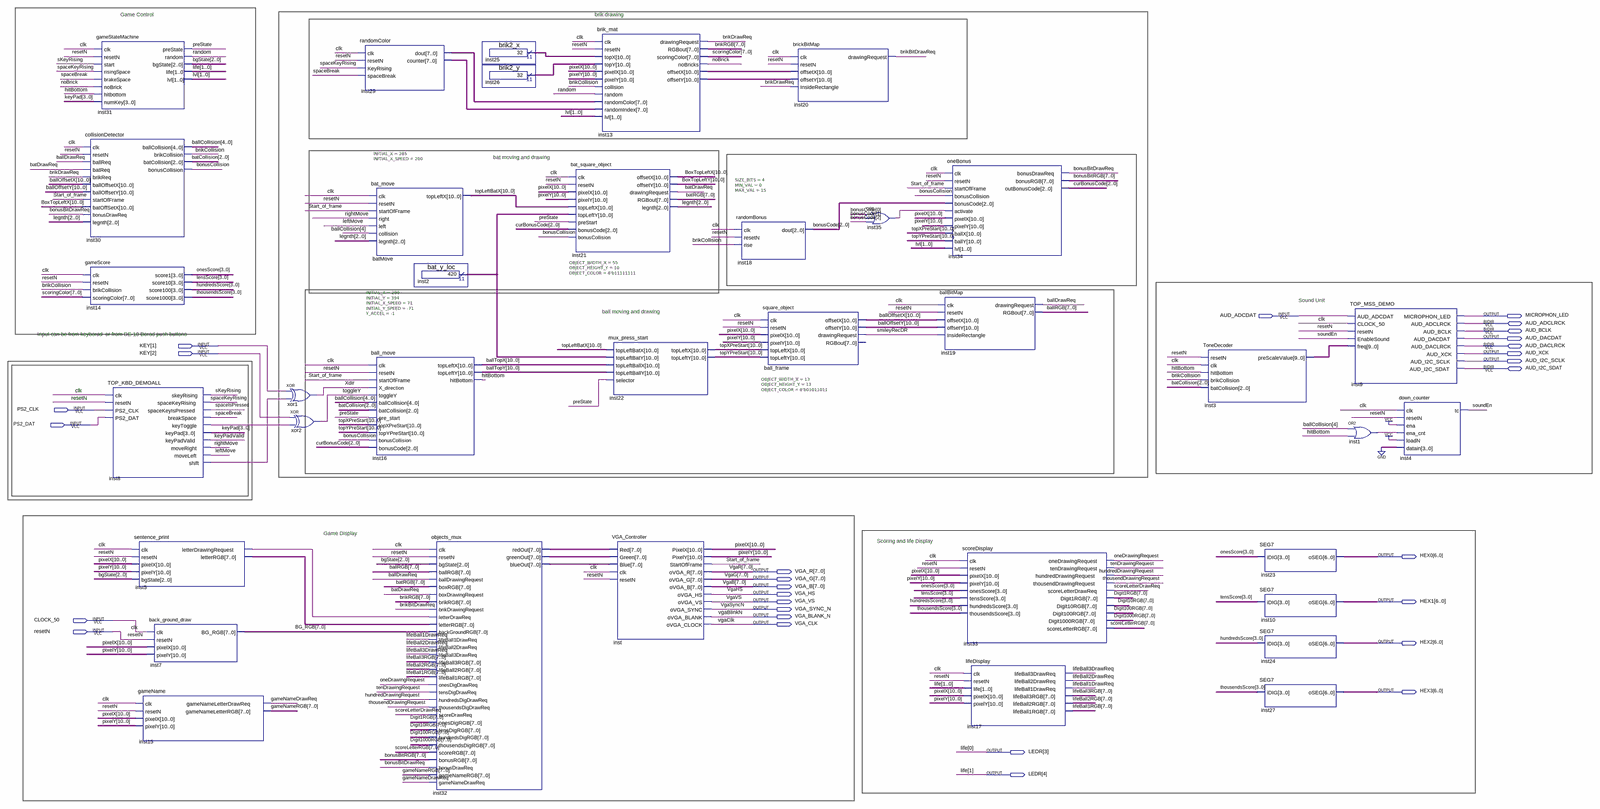
[diagram p0: schematic sheet, whole]
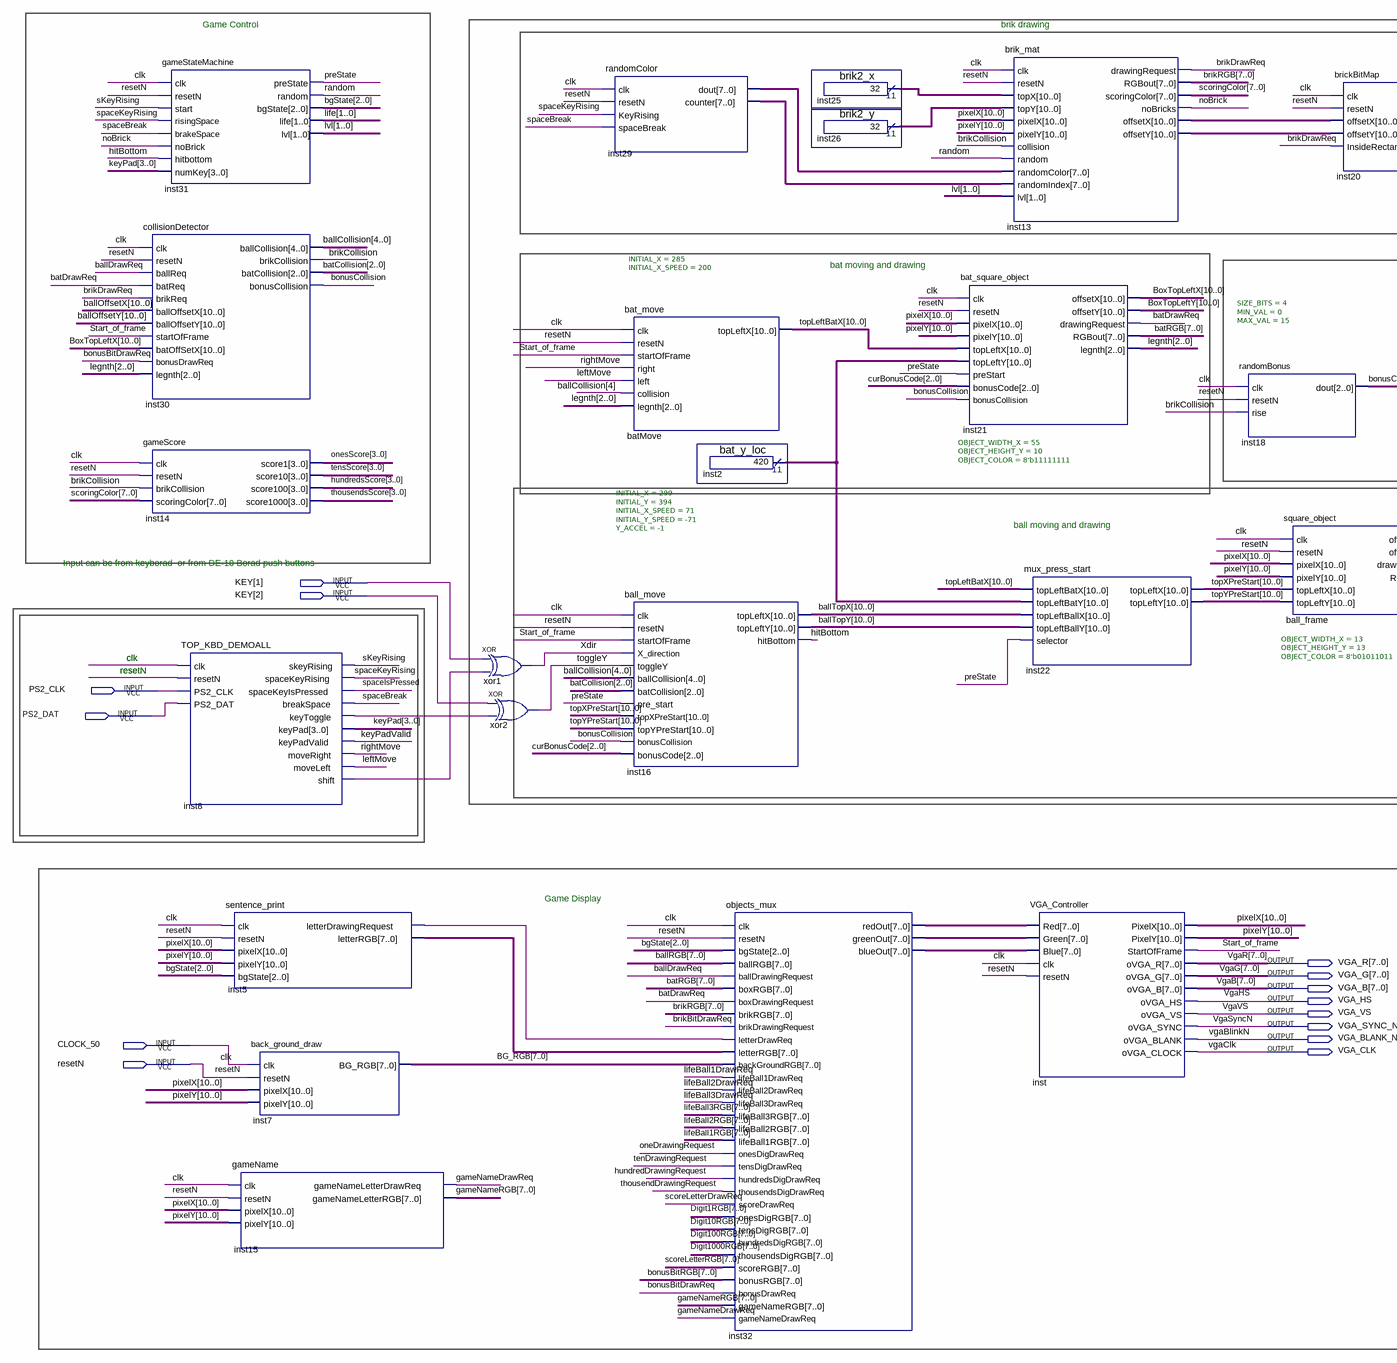
[diagram p1: schematic sheet, left part]
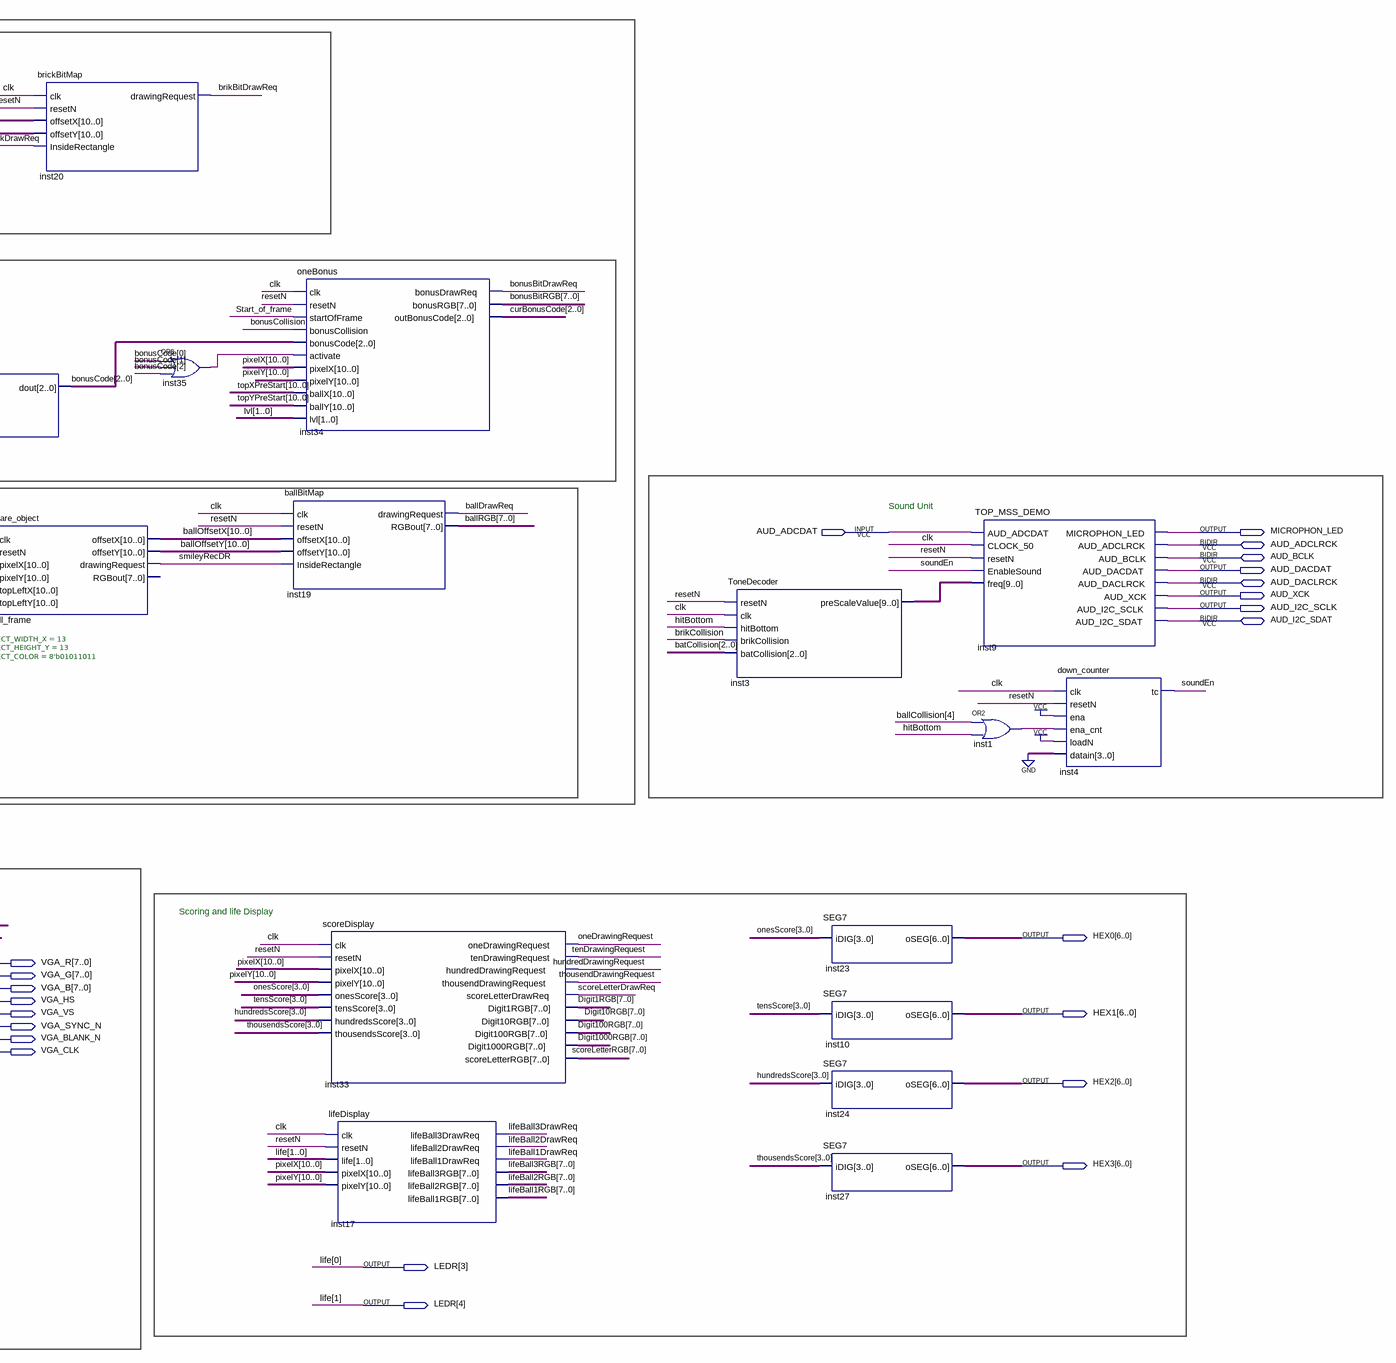
[diagram p2: schematic sheet, right part]
// Quartus schematic TOP_VGA_WITH_MSS_ALL.bdf as structural Verilog: 36 symbols, 29 pins
module TOP_VGA_WITH_MSS_ALL (
  input  AUD_ADCDAT,
  input  [2:1] KEY,
  input  PS2_CLK,
  input  PS2_DAT,
  input  CLOCK_50,
  input  resetN,
  inout  AUD_ADCLRCK,
  inout  AUD_BCLK,
  inout  AUD_DACLRCK,
  inout  AUD_I2C_SDAT,
  output MICROPHON_LED,
  output AUD_DACDAT,
  output AUD_XCK,
  output AUD_I2C_SCLK,
  output [6:0] HEX0,
  output [7:0] VGA_R,
  output [7:0] VGA_G,
  output [7:0] VGA_B,
  output VGA_HS,
  output VGA_VS,
  output [6:0] HEX1,
  output VGA_SYNC_N,
  output VGA_BLANK_N,
  output VGA_CLK,
  output [6:0] HEX2,
  output [6:0] HEX3,
  output [4:3] LEDR
);

  wire ballDrawReq, batDrawReq, bonusBitDrawReq, bonusCollision, brikBitDrawReq, brikCollision, brikDrawReq,
       gameNameDrawReq, hitBottom, hundredDrawingRequest, inst1_out, inst5_letterdrawingrequest,
       inst8_keytoggle, inst8_shift, inst35_out, keyPadValid, leftMove, lifeBall1DrawReq, lifeBall2DrawReq,
       lifeBall3DrawReq, noBrick, oneDrawingRequest, preState, random, rightMove, scoreLetterDrawReq,
       sKeyRising, smileyRecDR, soundEn, spaceBreak, spaceIsPressed, spaceKeyRising, Start_of_frame,
       tenDrawingRequest, thousendDrawingRequest, toggleY, Xdir;
  wire [1:0] lvl;
  wire [2:0] batCollision, bgState, bonusCode, curBonusCode, legnth;
  wire [3:0] hundredsScore, keyPad, onesScore, tensScore, thousendsScore;
  wire [4:0] ballCollision;
  wire [7:0] ballRGB, batRGB, BG_RGB, bonusBitRGB, brikRGB, Digit1RGB, Digit10RGB, Digit100RGB, Digit1000RGB,
       gameNameRGB, inst5_letterrgb, inst29_counter, inst29_dout, inst32_blueout, inst32_greenout,
       inst32_redout, lifeBall1RGB, lifeBall2RGB, lifeBall3RGB, scoreLetterRGB, scoringColor;
  wire [9:0] inst3_prescalevalue;
  wire [10:0] ballOffsetX, ballOffsetY, ballTopX, ballTopY, BoxTopLeftX, BoxTopLeftY, inst2_result,
       inst13_offsetx, inst13_offsety, inst25_result, inst26_result, pixelX, pixelY, topLeftBatX,
       topXPreStart, topYPreStart;

  gameStateMachine inst31 (
    .clk(CLOCK_50), .resetN(resetN), .start(sKeyRising), .risingSpace(spaceKeyRising),
    .brakeSpace(spaceBreak), .noBrick(noBrick), .hitbottom(hitBottom), .numKey(keyPad), .preState(preState),
    .random(random), .bgState(bgState), .life(LEDR), .lvl(lvl));
  collisionDetector inst30 (
    .clk(CLOCK_50), .resetN(resetN), .ballReq(ballDrawReq), .batReq(batDrawReq), .brikReq(brikDrawReq),
    .ballOffsetX(ballOffsetX), .ballOffsetY(ballOffsetY), .startOfFrame(Start_of_frame),
    .batOffSetX(BoxTopLeftX), .bonusDrawReq(bonusBitDrawReq), .legnth(legnth), .ballCollision(ballCollision),
    .brikCollision(brikCollision), .batCollision(batCollision), .bonusCollision(bonusCollision));
  gameScore inst14 (
    .clk(CLOCK_50), .resetN(resetN), .brikCollision(brikCollision), .scoringColor(scoringColor),
    .score1(onesScore), .score10(tensScore), .score100(hundredsScore), .score1000(thousendsScore));
  TOP_KBD_DEMOALL inst8 (
    .clk(CLOCK_50), .resetN(resetN), .PS2_CLK(PS2_CLK), .PS2_DAT(PS2_DAT), .skeyRising(sKeyRising),
    .spaceKeyRising(spaceKeyRising), .spaceKeyIsPressed(spaceIsPressed), .breakSpace(spaceBreak),
    .keyToggle(inst8_keytoggle), .keyPad(keyPad), .keyPadValid(keyPadValid), .moveRight(rightMove),
    .moveLeft(leftMove), .shift(inst8_shift));
  sentence_print inst5 (
    .clk(CLOCK_50), .resetN(resetN), .pixelX(pixelX), .pixelY(pixelY), .bgState(bgState),
    .letterDrawingRequest(inst5_letterdrawingrequest), .letterRGB(inst5_letterrgb));
  gameName inst15 (
    .clk(CLOCK_50), .resetN(resetN), .pixelX(pixelX), .pixelY(pixelY),
    .gameNameLetterDrawReq(gameNameDrawReq), .gameNameLetterRGB(gameNameRGB));
  back_ground_draw inst7 (.clk(CLOCK_50), .resetN(resetN), .pixelX(pixelX), .pixelY(pixelY), .BG_RGB(BG_RGB));
  xor xor1 (Xdir, KEY[1], inst8_shift);
  xor xor2 (toggleY, KEY[2], inst8_keytoggle);
  randomColor inst29 (
    .clk(CLOCK_50), .resetN(resetN), .KeyRising(spaceKeyRising), .spaceBreak(spaceBreak), .dout(inst29_dout),
    .counter(inst29_counter));
  bat_move #(.INITIAL_X(285), .INITIAL_X_SPEED(200)) batMove (
    .clk(CLOCK_50), .resetN(resetN), .startOfFrame(Start_of_frame), .right(rightMove), .left(leftMove),
    .collision(ballCollision[4]), .legnth(legnth), .topLeftX(topLeftBatX));
  ball_move #(.INITIAL_X(299), .INITIAL_Y(394), .INITIAL_X_SPEED(71), .INITIAL_Y_SPEED(-71), .Y_ACCEL(-1)) inst16 (
    .clk(CLOCK_50), .resetN(resetN), .startOfFrame(Start_of_frame), .X_direction(Xdir), .toggleY(toggleY),
    .ballCollision(ballCollision), .batCollision(batCollision), .pre_start(preState),
    .topXPreStart(topXPreStart), .topYPreStart(topYPreStart), .bonusCollision(bonusCollision),
    .bonusCode(curBonusCode), .topLeftX(ballTopX), .topLeftY(ballTopY), .hitBottom(hitBottom));
  bat_y_loc inst2 (.result(inst2_result));
  objects_mux inst32 (
    .clk(CLOCK_50), .resetN(resetN), .bgState(bgState), .ballRGB(ballRGB), .ballDrawingRequest(ballDrawReq),
    .boxRGB(batRGB), .boxDrawingRequest(batDrawReq), .brikRGB(brikRGB), .brikDrawingRequest(brikBitDrawReq),
    .letterDrawReq(inst5_letterdrawingrequest), .letterRGB(inst5_letterrgb), .backGroundRGB(BG_RGB),
    .lifeBall1DrawReq(lifeBall1DrawReq), .lifeBall2DrawReq(lifeBall2DrawReq),
    .lifeBall3DrawReq(lifeBall3DrawReq), .lifeBall3RGB(lifeBall3RGB), .lifeBall2RGB(lifeBall2RGB),
    .lifeBall1RGB(lifeBall1RGB), .onesDigDrawReq(oneDrawingRequest), .tensDigDrawReq(tenDrawingRequest),
    .hundredsDigDrawReq(hundredDrawingRequest), .thousendsDigDrawReq(thousendDrawingRequest),
    .scoreDrawReq(scoreLetterDrawReq), .onesDigRGB(Digit1RGB), .tensDigRGB(Digit10RGB),
    .hundredsDigRGB(Digit100RGB), .thousendsDigRGB(Digit1000RGB), .scoreRGB(scoreLetterRGB),
    .bonusRGB(bonusBitRGB), .bonusDrawReq(bonusBitDrawReq), .gameNameRGB(gameNameRGB),
    .gameNameDrawReq(gameNameDrawReq), .redOut(inst32_redout), .greenOut(inst32_greenout),
    .blueOut(inst32_blueout));
  brik2_x inst25 (.result(inst25_result));
  brik2_y inst26 (.result(inst26_result));
  bat_square_object #(.OBJECT_WIDTH_X(55), .OBJECT_HEIGHT_Y(10), .OBJECT_COLOR(8'b11111111)) inst21 (
    .clk(CLOCK_50), .resetN(resetN), .pixelX(pixelX), .pixelY(pixelY), .topLeftX(topLeftBatX),
    .topLeftY(inst2_result), .preStart(preState), .bonusCode(curBonusCode), .bonusCollision(bonusCollision),
    .offsetX(BoxTopLeftX), .offsetY(BoxTopLeftY), .drawingRequest(batDrawReq), .RGBout(batRGB),
    .legnth(legnth));
  brik_mat inst13 (
    .clk(CLOCK_50), .resetN(resetN), .topX(inst25_result), .topY(inst26_result), .pixelX(pixelX),
    .pixelY(pixelY), .collision(brikCollision), .random(random), .randomColor(inst29_dout),
    .randomIndex(inst29_counter), .lvl(lvl), .drawingRequest(brikDrawReq), .RGBout(brikRGB),
    .scoringColor(scoringColor), .noBricks(noBrick), .offsetX(inst13_offsetx), .offsetY(inst13_offsety));
  mux_press_start inst22 (
    .topLeftBatX(topLeftBatX), .topLeftBatY(inst2_result), .topLeftBallX(ballTopX), .topLeftBallY(ballTopY),
    .selector(preState), .topLeftX(topXPreStart), .topLeftY(topYPreStart));
  VGA_Controller inst (
    .Red(inst32_redout), .Green(inst32_greenout), .Blue(inst32_blueout), .clk(CLOCK_50), .resetN(resetN),
    .PixelX(pixelX), .PixelY(pixelY), .StartOfFrame(Start_of_frame), .oVGA_R(VGA_R), .oVGA_G(VGA_G),
    .oVGA_B(VGA_B), .oVGA_HS(VGA_HS), .oVGA_VS(VGA_VS), .oVGA_SYNC(VGA_SYNC_N), .oVGA_BLANK(VGA_BLANK_N),
    .oVGA_CLOCK(VGA_CLK));
  randomBonus #(.SIZE_BITS(4), .MIN_VAL(0), .MAX_VAL(15)) inst18 (
    .clk(CLOCK_50), .resetN(resetN), .rise(brikCollision), .dout(bonusCode));
  square_object #(.OBJECT_WIDTH_X(13), .OBJECT_HEIGHT_Y(13), .OBJECT_COLOR(8'b01011011)) ball_frame (
    .clk(CLOCK_50), .resetN(resetN), .pixelX(pixelX), .pixelY(pixelY), .topLeftX(topXPreStart),
    .topLeftY(topYPreStart), .offsetX(ballOffsetX), .offsetY(ballOffsetY), .drawingRequest(smileyRecDR));  // open: RGBout
  brickBitMap inst20 (
    .clk(CLOCK_50), .resetN(resetN), .offsetX(inst13_offsetx), .offsetY(inst13_offsety),
    .InsideRectangle(brikDrawReq), .drawingRequest(brikBitDrawReq));
  or inst35 (inst35_out, bonusCode[0], bonusCode[1], bonusCode[2]);
  oneBonus inst34 (
    .clk(CLOCK_50), .resetN(resetN), .startOfFrame(Start_of_frame), .bonusCollision(bonusCollision),
    .bonusCode(bonusCode), .activate(inst35_out), .pixelX(pixelX), .pixelY(pixelY), .ballX(topXPreStart),
    .ballY(topYPreStart), .lvl(lvl), .bonusDrawReq(bonusBitDrawReq), .bonusRGB(bonusBitRGB),
    .outBonusCode(curBonusCode));
  ballBitMap inst19 (
    .clk(CLOCK_50), .resetN(resetN), .offsetX(ballOffsetX), .offsetY(ballOffsetY),
    .InsideRectangle(smileyRecDR), .drawingRequest(ballDrawReq), .RGBout(ballRGB));
  scoreDisplay inst33 (
    .clk(CLOCK_50), .resetN(resetN), .pixelX(pixelX), .pixelY(pixelY), .onesScore(onesScore),
    .tensScore(tensScore), .hundredsScore(hundredsScore), .thousendsScore(thousendsScore),
    .oneDrawingRequest(oneDrawingRequest), .tenDrawingRequest(tenDrawingRequest),
    .hundredDrawingRequest(hundredDrawingRequest), .thousendDrawingRequest(thousendDrawingRequest),
    .scoreLetterDrawReq(scoreLetterDrawReq), .Digit1RGB(Digit1RGB), .Digit10RGB(Digit10RGB),
    .Digit100RGB(Digit100RGB), .Digit1000RGB(Digit1000RGB), .scoreLetterRGB(scoreLetterRGB));
  lifeDisplay inst17 (
    .clk(CLOCK_50), .resetN(resetN), .life(LEDR), .pixelX(pixelX), .pixelY(pixelY),
    .lifeBall3DrawReq(lifeBall3DrawReq), .lifeBall2DrawReq(lifeBall2DrawReq),
    .lifeBall1DrawReq(lifeBall1DrawReq), .lifeBall3RGB(lifeBall3RGB), .lifeBall2RGB(lifeBall2RGB),
    .lifeBall1RGB(lifeBall1RGB));
  ToneDecoder inst3 (
    .resetN(resetN), .clk(CLOCK_50), .hitBottom(hitBottom), .brikCollision(brikCollision),
    .batCollision(batCollision), .preScaleValue(inst3_prescalevalue));
  SEG7 inst23 (.iDIG(onesScore), .oSEG(HEX0));
  SEG7 inst10 (.iDIG(tensScore), .oSEG(HEX1));
  SEG7 inst24 (.iDIG(hundredsScore), .oSEG(HEX2));
  SEG7 inst27 (.iDIG(thousendsScore), .oSEG(HEX3));
  TOP_MSS_DEMO inst9 (
    .AUD_ADCDAT(AUD_ADCDAT), .CLOCK_50(CLOCK_50), .resetN(resetN), .EnableSound(soundEn),
    .freq(inst3_prescalevalue), .MICROPHON_LED(MICROPHON_LED), .AUD_DACDAT(AUD_DACDAT), .AUD_XCK(AUD_XCK),
    .AUD_I2C_SCLK(AUD_I2C_SCLK), .AUD_ADCLRCK(AUD_ADCLRCK), .AUD_BCLK(AUD_BCLK), .AUD_DACLRCK(AUD_DACLRCK),
    .AUD_I2C_SDAT(AUD_I2C_SDAT));
  or inst1 (inst1_out, ballCollision[4], hitBottom);
  down_counter inst4 (
    .clk(CLOCK_50), .resetN(resetN), .ena(1'b1), .ena_cnt(inst1_out), .loadN(1'b1), .datain(4'b0000),
    .tc(soundEn));

  // Other names for the same wires on the sheet: clk = CLOCK_50; life[1:0] = LEDR; VgaB[7:0] = VGA_B;
  //   vgaBlinkN = VGA_BLANK_N; vgaClk = VGA_CLK; VgaG[7:0] = VGA_G; VgaHS = VGA_HS; VgaR[7:0] = VGA_R;
  //   VgaSyncN = VGA_SYNC_N; VgaVS = VGA_VS

  // Notes on the sheet:
  //   Game Control
  //   brik drawing
  //   bat moving and drawing
  //   Sound Unit
  //   ball moving and drawing
  //   Input can be from keyborad  or from DE-10 Borad push buttons  
  //   clk
  //   resetN
  //   Game Display
  //   Scoring and life Display 
endmodule
